# Altium schematic sheet Microcontroller.SchDoc: Microcontroller
size A4; Date: 6.4.2015; Engineer: Matjaž Tome; DocumentNumber: 4; Revision: B; SheetNumber: 2; SheetTotal: 10; Project: USB DAQ
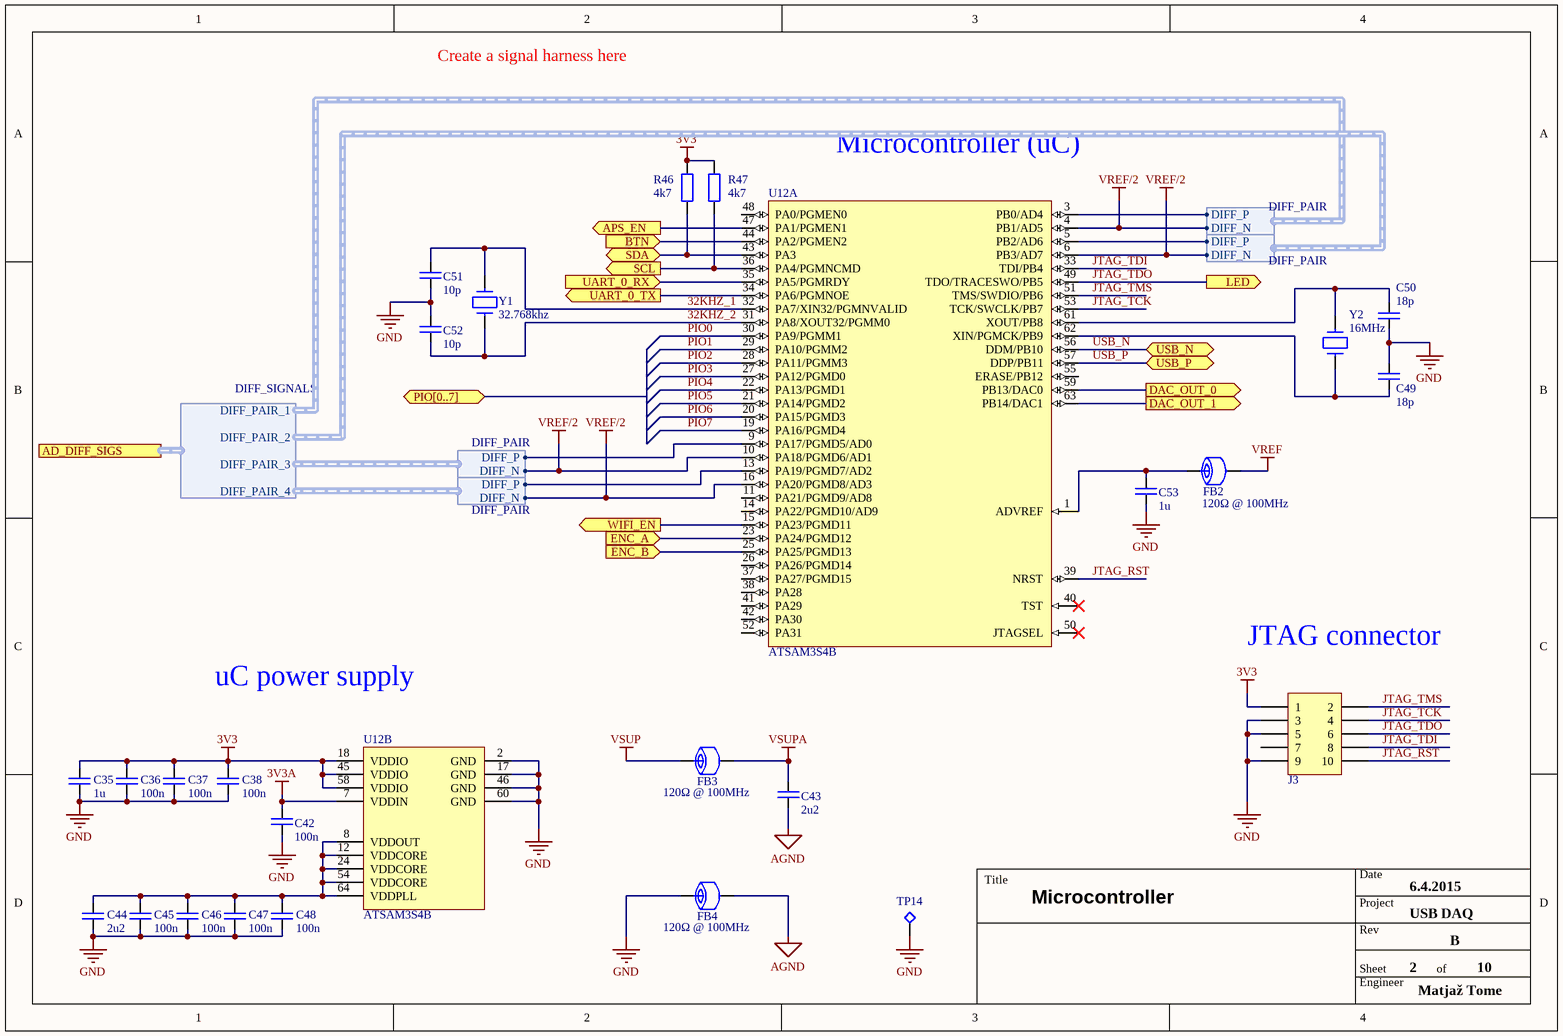
[diagram p0: Microcontroller.SchDoc]

## Parts
C35  1u  [C_0603]
C36  100n  [C_0603]
C37  100n  [C_0603]
C38  100n  [C_0603]
C42  100n  [C_0603]
C43  2u2  [C_0603]
C44  2u2  [C_0603]
C45  100n  [C_0603]
C46  100n  [C_0603]
C47  100n  [C_0603]
C48  100n  [C_0603]
C49  18p  [C_0603]
C50  18p  [C_0603]
C51  10p  [C_0603]
C52  10p  [C_0603]
C53  1u  [C_0603]
FB2  120Ω @ 100MHz  [SMD_0805]
FB3  120Ω @ 100MHz  [SMD_0805]
FB4  120Ω @ 100MHz  [SMD_0805]
J3  M50-3600542  [HEADER_2X05_1.27mm]  (value not drawn)
R46  4k7  [R_0603]
R47  4k7  [R_0603]
TP14  testpoint  [TP1_FULL]  (value not drawn)
U12  ATSAM3S4B  [LQFP64]  (parts A,B of 2)
Y1  32.768khz  [2X6_FLAT]
Y2  16MHz  [5X3.2]

## Ports
AD_DIFF_SIGS (harness DIFF_SIGNALS), APS_EN (out), BTN (in), DAC_OUT_0 (out), DAC_OUT_1 (out), ENC_A (in), ENC_B (in), LED (out), PIO[0..7] (bidir), SCL (out), SDA (bidir), UART_0_RX (in), UART_0_TX (out), USB_N (bidir), USB_P (bidir), WIFI_EN (out)

## Harnesses
DIFF_SIGNALS: DIFF_PAIR_1, DIFF_PAIR_2, DIFF_PAIR_3, DIFF_PAIR_4
DIFF_PAIR: DIFF_N, DIFF_P

## Nets
3V3: C35.1 C36.1 C37.1 C38.1 J3.1 R46.2 R47.2 U12.18(VDDIO) U12.45(VDDIO) U12.58(VDDIO)
3V3A: C42.1 U12.7(VDDIN)
AGND: C43.2 FB4.2
GND: C35.2 C36.2 C37.2 C38.2 C42.2 C44.2 C45.2 C46.2 C47.2 C48.2 C49.2 C50.2 C51.2 C52.2 C53.2 FB4.1 J3.3 J3.5 J3.9 TP14.1 U12.2(GND) U12.17(GND) U12.46(GND) U12.60(GND)
VREF: FB2.2
VREF/2: U12.4(PB1/AD5) U12.6(PB3/AD7) U12.10(PA18/PGMD6/AD1) U12.16(PA20/PGMD8/AD3) ; harness DIFF_PAIR.DIFF_N
VSUP: FB3.1
VSUPA: C43.1 FB3.2
32KHZ_1: C51.1 U12.32(PA7/XIN32/PGMNVALID) Y1.2
32KHZ_2: C52.1 U12.31(PA8/XOUT32/PGMM0) Y1.1
APS_EN: U12.47(PA1/PGMEN1) ; port APS_EN
BTN: U12.44(PA2/PGMEN2) ; port BTN
DAC_OUT_0: U12.59(PB13/DAC0) ; port DAC_OUT_0
DAC_OUT_1: U12.63(PB14/DAC1) ; port DAC_OUT_1
ENC_A: U12.23(PA24/PGMD12) ; port ENC_A
ENC_B: U12.25(PA25/PGMD13) ; port ENC_B
JTAG_RST: J3.10 U12.39(NRST)
JTAG_TCK: J3.4 U12.53(TCK/SWCLK/PB7)
JTAG_TDI: J3.8 U12.33(TDI/PB4)
JTAG_TDO: J3.6 U12.49(TDO/TRACESWO/PB5) ; port LED
JTAG_TMS: J3.2 U12.51(TMS/SWDIO/PB6)
PIO0: U12.30(PA9/PGMM1)
PIO1: U12.29(PA10/PGMM2)
PIO2: U12.28(PA11/PGMM3)
PIO3: U12.27(PA12/PGMD0)
PIO4: U12.22(PA13/PGMD1)
PIO5: U12.21(PA14/PGMD2)
PIO6: U12.20(PA15/PGMD3)
PIO7: U12.19(PA16/PGMD4)
SCL: R47.1 U12.36(PA4/PGMNCMD) ; port SCL
SDA: R46.1 U12.43(PA3) ; port SDA
UART_0_RX: U12.35(PA5/PGMRDY) ; port UART_0_RX
UART_0_TX: U12.34(PA6/PGMNOE) ; port UART_0_TX
USB_N: U12.56(DDM/PB10) ; port USB_N
USB_P: U12.57(DDP/PB11) ; port USB_P
WIFI_EN: U12.15(PA23/PGMD11) ; port WIFI_EN
NetC44_1: C44.1 C45.1 C46.1 C47.1 C48.1 U12.8(VDDOUT) U12.12(VDDCORE) U12.24(VDDCORE) U12.54(VDDCORE) U12.64(VDDPLL)
NetC49_1: C49.1 U12.62(XIN/PGMCK/PB9) Y2.1
NetC50_1: C50.1 U12.61(XOUT/PB8) Y2.2
NetC53_1: C53.1 FB2.1 U12.1(ADVREF)
NetU12_3: U12.3(PB0/AD4) ; harness DIFF_PAIR.DIFF_P
NetU12_5: U12.5(PB2/AD6) ; harness DIFF_PAIR.DIFF_P
NetU12_9: U12.9(PA17/PGMD5/AD0) ; harness DIFF_PAIR.DIFF_P
NetU12_13: U12.13(PA19/PGMD7/AD2) ; harness DIFF_PAIR.DIFF_P

Not connected (* = marked no-connect by the designer): J3 7; U12 11(PA21/PGMD9/AD8) 14(PA22/PGMD10/AD9) 26(PA26/PGMD14) 37(PA27/PGMD15) 38(PA28) 40(TST)* 41(PA29) 42(PA30) 48(PA0/PGMEN0) 50(JTAGSEL)* 52(PA31) 55(ERASE/PB12)

## Notes on the sheet
- Create a signal harness here
- Microcontroller (uC)
- JTAG connector
- uC power supply
- Title
- Date
- Project
- Rev
- Engineer
- Sheet
- of

## Library data of the parts
C35-C38 C42-C53 = Capacitor: Generic capacitor
  C35 C53: Value: 1u
  C36-C38 C42 C45-C48: Value: 100n
  C43 C44: Value: 2u2
  C49 C50: Value: 18p
  C51 C52: Value: 10p
FB2-FB4 = BLM21AG121SN1D: Ferrite Bead, 0805 [2012 Metric], 120 ohm, 800 mA, BLM21A Series, 0.15 ohm, ± 25%; Manufacturer: Murata; Dealer number: 1515617; Dealer: Farnell; DC resistance: 0.15Ω; Max current: 0.2A; Category: ferite beads; Price: 0.082; Manufacturer Number: BLM21AG121SN1D; AC resistance: 120Ω; Frequency: 100MHz; Case: 0805; Technology: SMT; HelpURL: https://www.farnell.com/datasheets/1914683.pdf
J3 = M50-3600542: Pin Header, Board-to-Board, 1.27 mm, 2 Rows, 10 Contacts, Surface Mount, Archer M50 Series; Manufacturer: Harwin; Dealer number: 1022310; Dealer: Farnell; Gender: Male; Rows: 2; Pitch: 1.27mm; Category: Connectors; Price: 0.90; Manufacturer Number: M50-3600542; Pins: 5; Orientation: strait; Technology: SMD; HelpURL: https://cdn.harwin.com/pdfs/M50-360.pdf
R46 R47 = Resistor: Generic resistor; Value: 4k7
TP14 = Test Point: testpoint 1.5mm diameter no hole; Part Number: XXC0006; Category: testpoints
U12 = ATSAM3SXB: Cortex M3 ARM microcontroller; Part Number: XAM0003; Manufacturer: Atmel; Manufacturer Number: ATSAM3S4BA-AU; Dealer number: 1841656; Dealer: Farnell; Core: Cortex-M3; Supply voltage max: 3.6V; Supply voltage min: 1.62V; Flash: 256kB; RAM: 48kB; GPIOs: 47; Timers: 3; ADCs: 8; SPI: 1; IIC: 2; Max Frequency: 64MHz; Category: Integrated circuits; Price: 6.58; UART: 3; Case: LQFP64; Technology: SMT; HelpURL: https://www.farnell.com/datasheets/1698183.pdf; Temperature range: -40°C to +85°C
Y1 = R26-32.768- 12.5: Crystal, 32.768 kHz, Cylinder Radial, 6.2mm x 2mm Dia, 12.5 pF, 20 ppm, R26 Series; Part Number: XCR0010; Manufacturer: RALTRON; Dealer number: 1652573; Dealer: Farnell; Value: 32.758khz; Load capacitance: 12pF; Frequency tolerance: 20ppm; Category: Crystals; Price: 0.18; Manufacturer Number: R26-32.768- 12.5; Technology: THT; Case: 5X3.2_1; HelpURL: http://www.ramitechnology.com/products/spec/crystal/crystal-r38_26_145.pdf
Y2 = 7A-16.000MAAJ-T: Crystal, 16 MHz, SMD, 5mm x 3.2mm, 30 ppm, 18 pF, 30 ppm, 7A Series; Manufacturer: TCX; Dealer number: 1841946; Dealer: Farnell; Load capacitance: 18pF; Frequency tolerance: 30ppm; Category: Crystals; Price: 0.91; Manufacturer Number: 7A-16.000MAAJ-T; Value: 16MHz; Technology: SMT; Case: 5X3.2; HelpURL: https://www.farnell.com/datasheets/1041607.pdf